# EAGLE schematic OLM-base-v.REV-2-SMT (EAGLE 6.4)
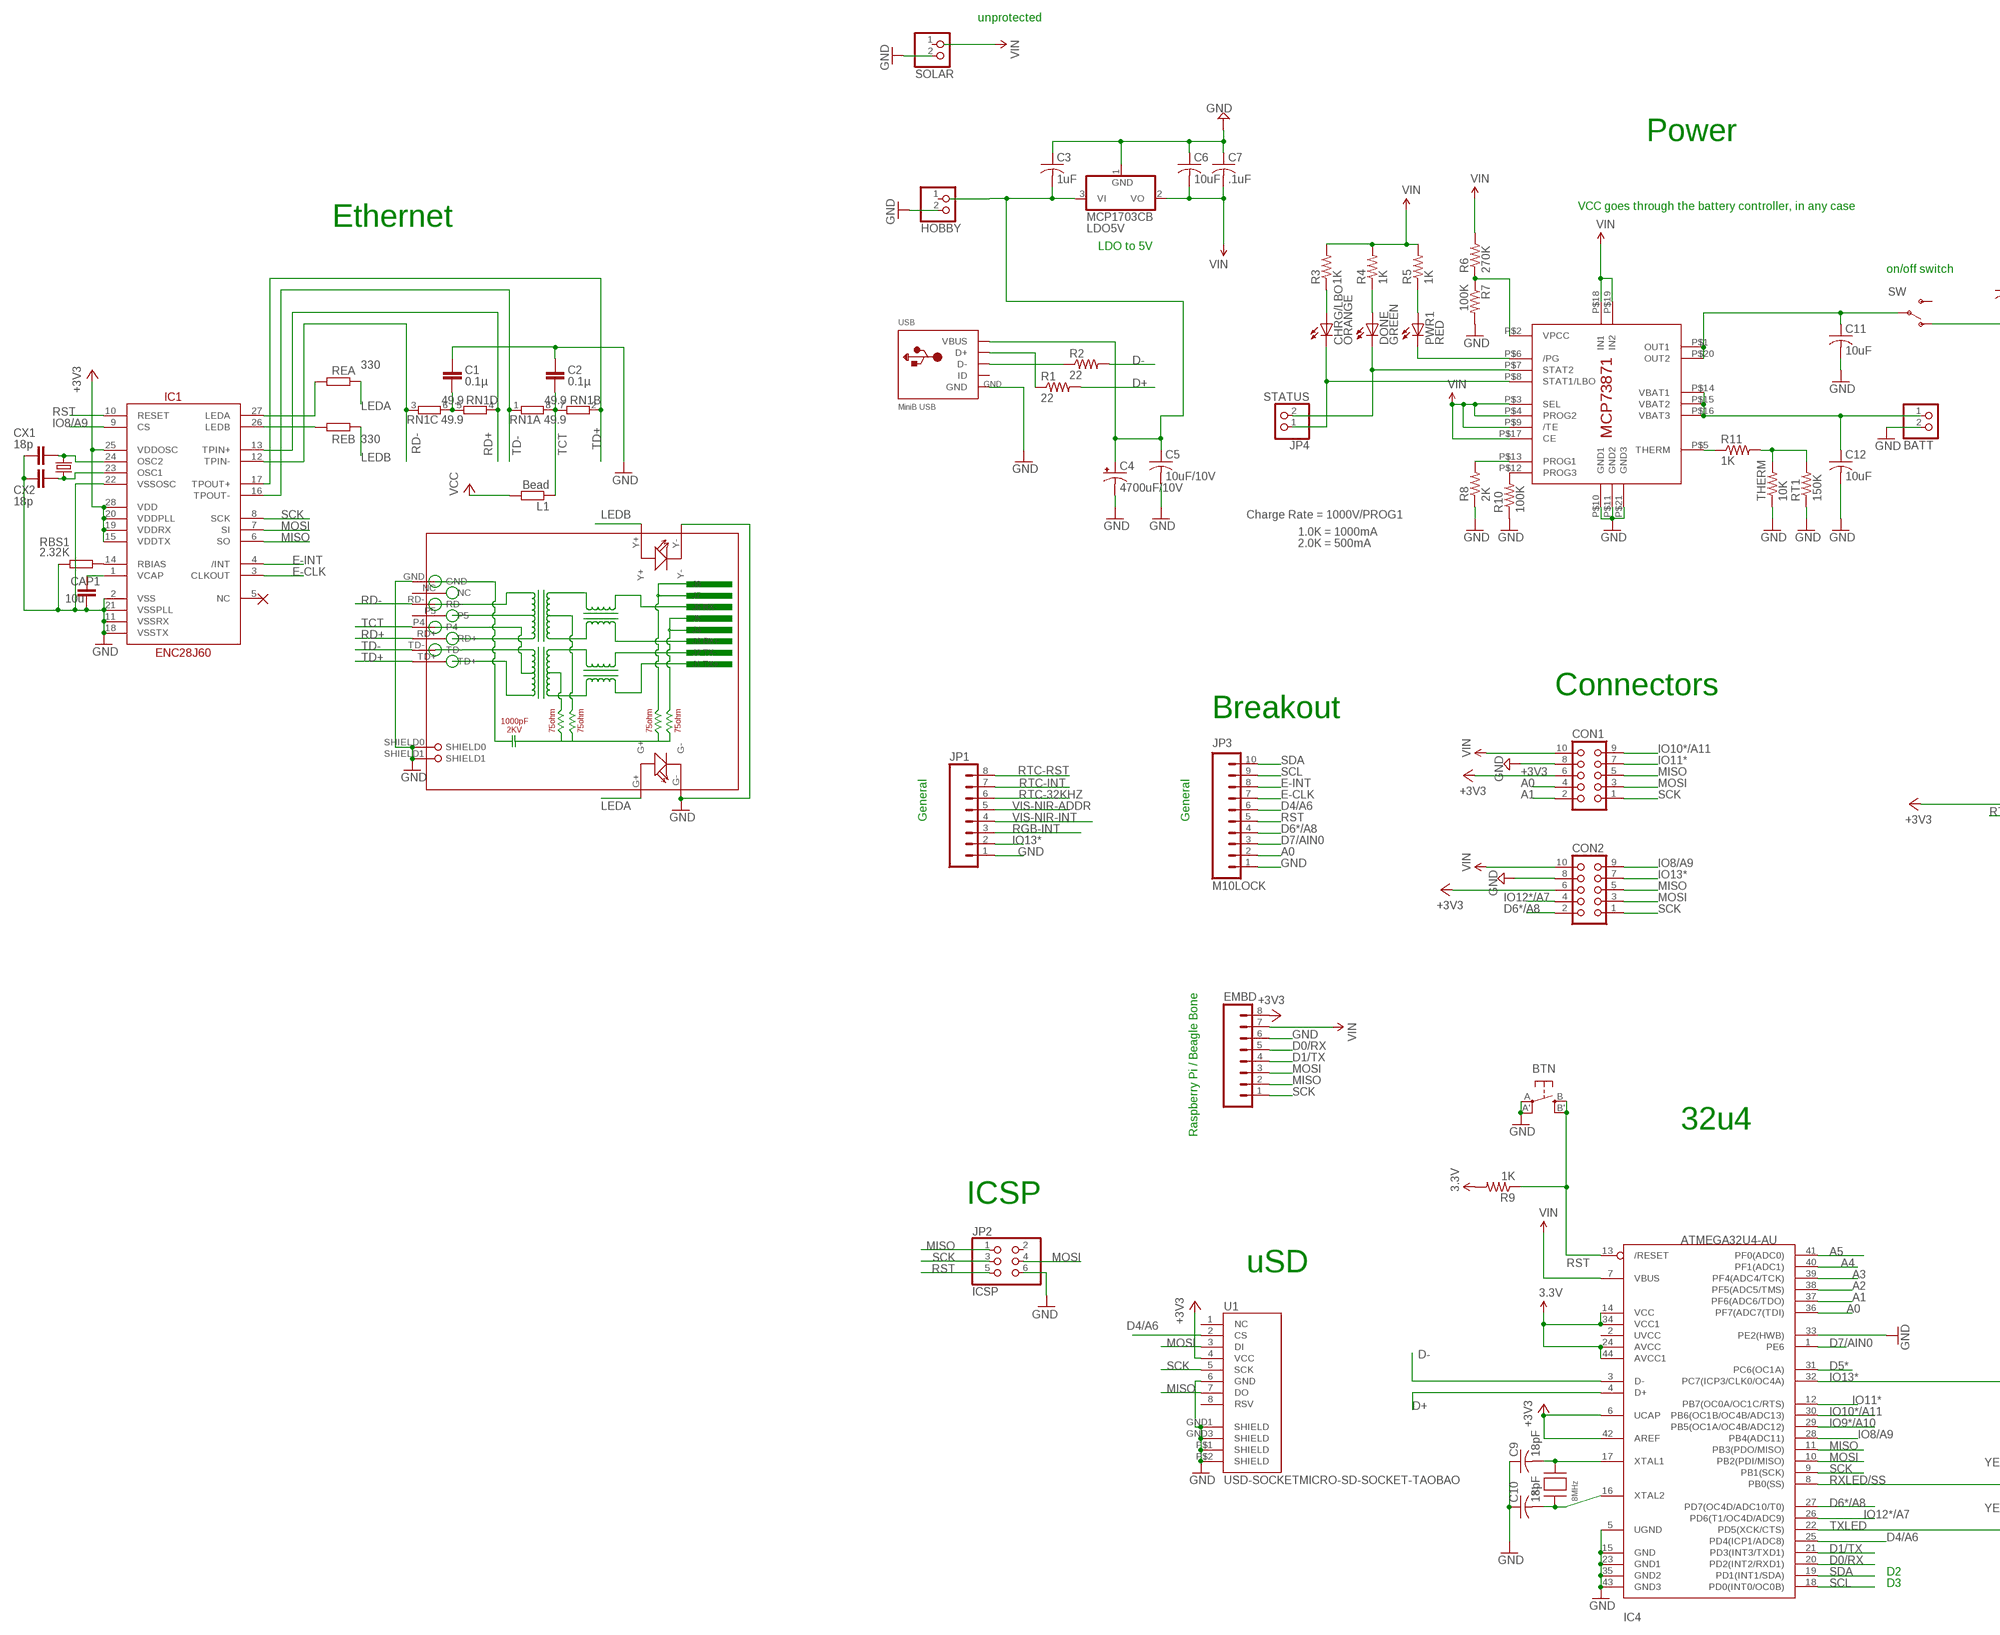
[diagram p0: schematic, sheet 1, part 1 of 2]
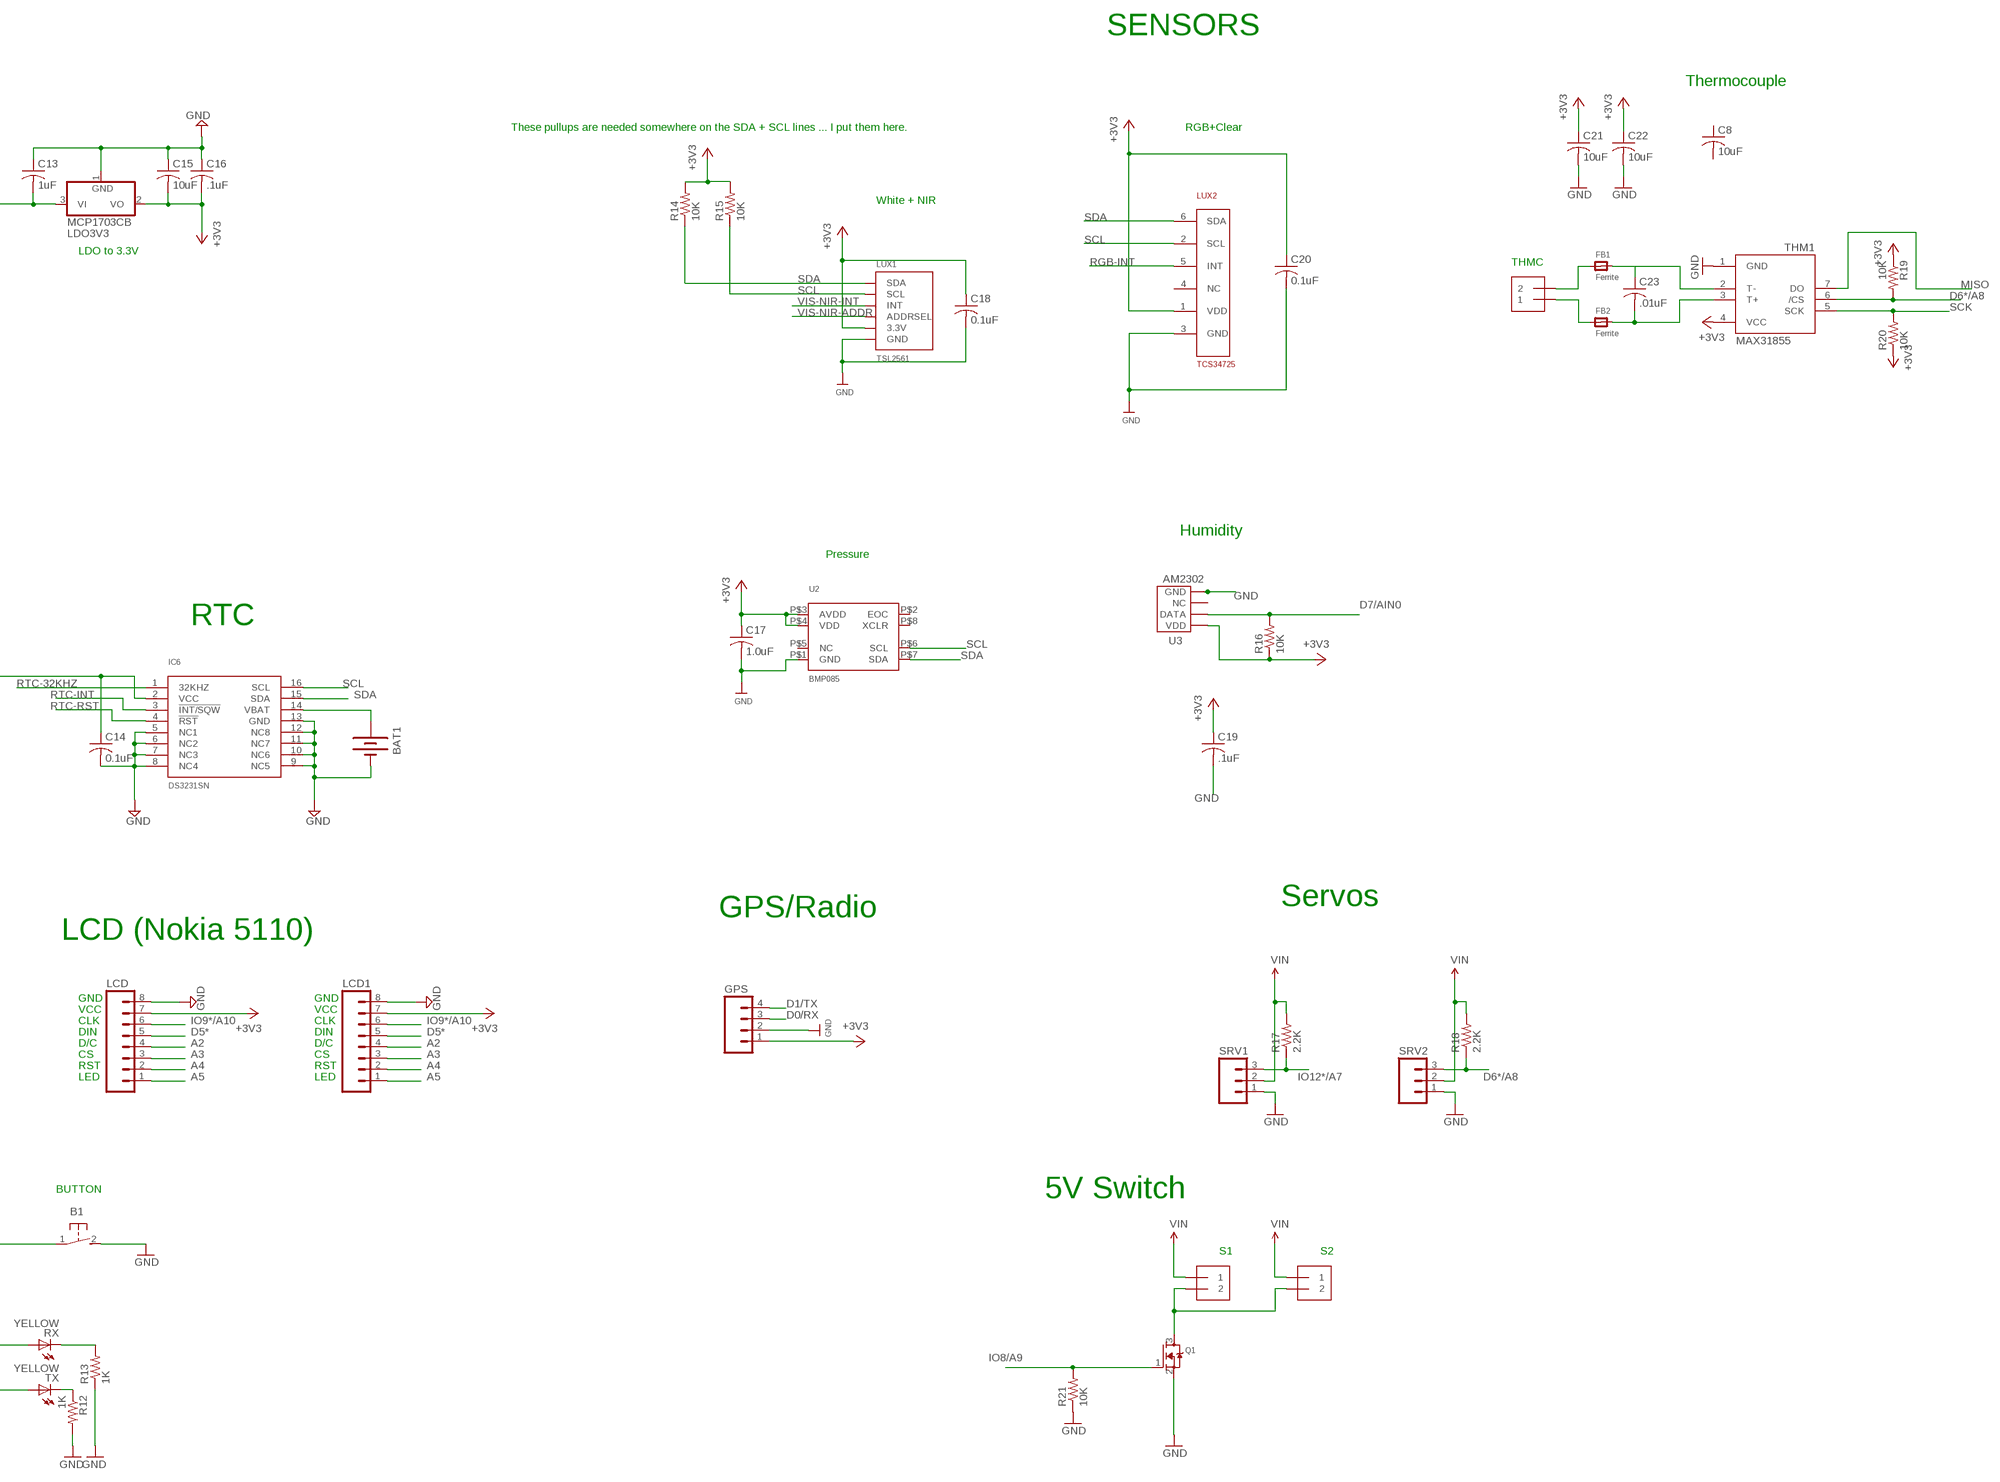
[diagram p1: schematic, sheet 1, part 2 of 2]

## Parts
B1  31-XX  [B3F-31XX]
BAT1  BATTERYBATTERY_12MM_SMT  [BATTCON_12MM_SMT]
BATT  JST_2PIN-SMT-RA  [JST-PH-2-SMT-RA]
BTN  EVQQ2  [EVQ-Q2]
C1  0.1µ  C-EUC0805  [C0805]
C2  0.1µ  C-EUC0805  [C0805]
C3  1uF  C-USC0805  [C0805]
C4  4700uF/10V  CPOL-USE5-13  [E5-13]
C5  10uF/10V  C-USC0805  [C0805]
C6  10uF  C-USC0805  [C0805]
C7  .1uF  C-USC0805  [C0805]
C8  10uF  C-USC0805  [C0805]
C9  18pF  C-USC0805  [C0805]
C10  18pF  C-USC0805  [C0805]
C11  10uF  C-USC0805  [C0805]
C12  10uF  C-USC0805  [C0805]
C13  1uF  C-USC0805  [C0805]
C14  0.1uF  C-USC0805  [C0805]
C15  10uF  C-USC0805  [C0805]
C16  .1uF  C-USC0805  [C0805]
C17  1.0uF  C-USC0805  [C0805]
C18  0.1uF  C-USC0805  [C0805]
C19  .1uF  C-USC0805  [C0805]
C20  0.1uF  C-USC0805  [C0805]
C21  10uF  C-USC0805  [C0805]
C22  10uF  C-USC0805  [C0805]
C23  .01uF  C-USC0805  [C0805]
CAP1  10u  C-EUC0805  [C0805]
CHRG/LBO  ORANGE  LEDCHIP-LED0805  [CHIP-LED0805]
CON1  CON10L  [CON10L]
CON2  CON10L  [CON10L]
CX1  18p  C-EUC0805  [C0805]
CX2  18p  C-EUC0805  [C0805]
DONE  GREEN  LEDCHIP-LED0805  [CHIP-LED0805]
EMBD  M08LOCK  [1X08_LOCK]
FB1  Ferrite  FERRITE_0805  [_0805]
FB2  Ferrite  FERRITE_0805  [_0805]
GPS  M04LOCK  [1X04_LOCK]
HOBBY  JST_2PIN-SMT-RA  [JST-PH-2-SMT-RA]
IC1  ENC28J60  ENC28J60SO28LONG  [SOIC28WLONG]
IC3  MCP73871  [QFN20_4MM]
IC4  ATMEGA32U4-AU  [TQFP44]
IC6  DS3231SN  [SO16W]
JP1  M08LOCK  [1X08_LOCK]
JP2  ICSP  PINHD-2X3  [2X03]
JP3  M10LOCK  [1X10_LOCK]
JP4  STATUS  HEADER-1X2  [1X02_OVAL]
L1  Bead  R-EU_R0805  [R0805]
LCD  M08LOCK  [1X08_LOCK]
LCD1  M08LOCK  [1X08_LOCK]
LDO3V3  MCP1703CB  [SOT23]
LDO5V  MCP1703CB  [SOT23]
LUX1  TSL2561  [TSL2561_FN@1]
LUX2  TCS34725  [DFN-6]
PWR1  RED  LEDCHIP-LED0805  [CHIP-LED0805]
Q1  MOSFET-NREFLOW  [SOT23]
R1  22  R-US_R0805  [R0805]
R2  22  R-US_R0805  [R0805]
R3  1K  R-US_R0805  [R0805]
R4  1K  R-US_R0805  [R0805]
R5  1K  R-US_R0805  [R0805]
R6  270K  R-US_R0805  [R0805]
R7  100K  R-US_R0805  [R0805]
R8  2K  R-US_FLIPFLOP  [0805-THM]
R9  1K  R-US_R0805  [R0805]
R10  100K  R-US_R0805  [R0805]
R11  1K  R-US_M0805  [M0805]
R12  1K  R-US_R0805  [R0805]
R13  1K  R-US_R0805  [R0805]
R14  10K  R-US_R0805  [R0805]
R15  10K  R-US_R0805  [R0805]
R16  10K  R-US_R0805  [R0805]
R17  2.2K  R-US_R0805  [R0805]
R18  2.2K  R-US_R0805  [R0805]
R19  10K  R-US_R0805  [R0805]
R20  10K  R-US_R0805  [R0805]
R21  10K  R-US_R0805  [R0805]
RBS1  2.32K  R-EU_R0805  [R0805]
REA  330  R-EU_R0805  [R0805]
REB  330  R-EU_R0805  [R0805]
RJ1  HR911105A  [HR911105A]
RN1  49.9  4R-NEXB38V  [EXB38V]
RT1  150K  R-US_M0805  [M0805]
RX  YELLOW  LEDCHIPLED_0805  [CHIPLED_0805]
S1  1X2-3.5MM  [1X2-3.5MM]
S2  1X2-3.5MM  [1X2-3.5MM]
SOLAR  JST_2PIN-SMT-RA  [JST-PH-2-SMT-RA]
SRV1  M03PTH  [1X03]
SRV2  M03PTH  [1X03]
SW  SPDT  SWITCH-SPSTSMD2  [SWITCH-SPDT-SMD]
THERM  10K  R-US_FLIPFLOP  [0805-THM]
THM1  MAX31855  MAX6675  [SO08]
THMC  1X2-3.5MM  [1X2-3.5MM]
TX  YELLOW  LEDCHIPLED_0805  [CHIPLED_0805]
U1  USD-SOCKETMICRO-SD-SOCKET-TAOBAO  [MICRO-SD-SOCKET-TAOBAO]
U2  BMP085  [BMP085]
U3  AM2302  [AM2302]
USB  MiniB USB  USBMINIBLARGE  [USB-MINIB_LARGER]
X1  8MHz  XTALNX5032  [NX5032]
X2A  25MHz  CRYSTAL10.5X4.8  [CRYSTAL-SMD-10.5X4.8-2PIN]

## Nets
+3V3: C14.1 C15.2 C16.2 C17.1 C18.1 C19.1 C20.1 C21.1 C22.1 CON1.6 CON2.6 EMBD.8 GPS.1 IC1.15(VDDTX) IC1.19(VDDRX) IC1.20(VDDPLL) IC1.25(VDDOSC) IC1.28(VDD) IC4.6(UCAP) IC4.42(AREF) IC6.2(VCC) LCD1.7 LCD.7 LDO3V3.2(VO) LUX1.VDD(3.3V) LUX2.1(VDD) R14.2 R15.2 R16.1 R19.1 R20.1 THM1.4(VCC) U1.4(VCC) U2.P$3(AVDD) U2.P$4(VDD) U3.P$1(VDD)
A0: CON1.4 IC4.36(PF7(ADC7(TDI)) JP3.2
A1: CON1.2 IC4.37(PF6(ADC6/TDO))
A2: IC4.38(PF5(ADC5/TMS)) LCD1.4 LCD.4
A3: IC4.39(PF4(ADC4/TCK)) LCD1.3 LCD.3
A4: IC4.40(PF1(ADC1)) LCD1.2 LCD.2
A5: IC4.41(PF0(ADC0)) LCD1.1 LCD.1
BATT: BATT.1 C12.1 IC3.P$14(VBAT1) IC3.P$15(VBAT2) IC3.P$16(VBAT3)
D0/RX: EMBD.5 GPS.3 IC4.20(PD2(INT2/RXD1))
D1/TX: EMBD.4 GPS.4 IC4.21(PD3(INT3/TXD1))
D4/A6: IC4.25(PD4(ICP1/ADC8)) JP3.6 U1.2(CS)
D5*: IC4.31(PC6(OC1A)) LCD1.5 LCD.5
D6*/A8: CON2.2 IC4.27(PD7(OC4D/ADC10/T0)) JP3.4 R18.1 R19.2 SRV2.3 THM1.6(/CS)
D7/AIN0: IC4.1(PE6) JP3.3 R16.2 U3.P$2(DATA)
D+: IC4.4(D+) R1.2
D-: IC4.3(D-) R2.2
E-CLK: IC1.3(CLKOUT) JP3.7
E-INT: IC1.4(/INT) JP3.8
GND: B1.2(S) BAT1.P$1(-) BATT.2 BTN.A'(P1) BTN.A(P) C1.1 C2.1 C3.1 C4.- C5.2 C6.1 C7.1 C9.1 C10.1 C11.2 C12.2 C13.1 C14.2 C15.1 C16.1 C17.2 C18.2 C19.2 C20.2 C21.2 C22.2 CAP1.2 CON1.8 CON2.8 CX1.2 CX2.2 EMBD.6 GPS.2 HOBBY.2 IC1.2(VSS) IC1.11(VSSRX) IC1.18(VSSTX) IC1.21(VSSPLL) IC1.22(VSSOSC) IC3.P$10(GND1) IC3.P$11(GND2) IC3.P$21(GND3) IC4.5(UGND) IC4.15(GND) IC4.23(GND1) IC4.33(PE2(HWB)) IC4.35(GND2) IC4.43(GND3) IC6.5(NC1) IC6.6(NC2) IC6.7(NC3) IC6.8(NC4) IC6.9(NC5) IC6.10(NC6) IC6.11(NC7) IC6.12(NC8) IC6.13(GND) JP1.1 JP2.6 JP3.1 LCD1.8 LCD.8 LDO3V3.1(GND) LDO5V.1(GND) LUX1.VSS(GND) LUX2.3(GND) Q1.2(S) R7.2 R8.1 R10.1 R12.2 R13.1 R21.1 RBS1.1 RJ1.G- RJ1.GND RJ1.SHIELD0 RJ1.SHIELD1 RJ1.Y- RT1.1 SOLAR.2 SRV1.1 SRV2.1 THERM.1 THM1.1(GND) U1.6(GND) U1.GND1(SHIELD) U1.GND3(SHIELD) U1.P$1(SHIELD) U1.P$2(SHIELD) U2.P$1(GND) U3.P$4(GND) USB.GND
HIGH-CURRENT: Q1.3(D) S1.2 S2.2
IO8/A9: CON2.9 IC1.9(CS) IC4.28(PB4(ADC11)) Q1.1(G) R21.2
IO9*/A10: IC4.29(PB5(OC1A/OC4B/ADC12)) LCD1.6 LCD.6
IO10*/A11: CON1.9 IC4.30(PB6(OC1B/OC4B/ADC13))
IO11*: CON1.7 IC4.12(PB7(OC0A/OC1C/RTS))
IO12*/A7: CON2.4 IC4.26(PD6(T1/OC4D/ADC9)) R17.1 SRV1.3
IO13*: B1.1(P) CON2.7 IC4.32(PC7(ICP3/CLK0/OC4A)) JP1.2
LEDA: REA.2 RJ1.G+
LEDB: REB.2 RJ1.Y+
MISO: CON1.5 CON2.5 EMBD.2 IC1.6(SO) IC4.11(PB3(PDO/MISO)) JP2.1 THM1.7(DO) U1.7(DO)
MOSI: CON1.3 CON2.3 EMBD.3 IC1.7(SI) IC4.10(PB2(PDI/MISO)) JP2.4 U1.3(DI)
N$1: BAT1.P$2(+) IC6.14(VBAT)
N$2: IC1.27(LEDA) REA.1
N$3: FB1.1 THMC.2
N$4: C23.1 FB1.2 THM1.2(T-)
N$5: FB2.1 THMC.1
N$6: C23.2 FB2.2 THM1.3(T+)
N$8: C9.2 IC4.17(XTAL1) X1.P$2
N$9: C10.2 IC4.16(XTAL2) X1.P$1
N$10: C1.2 RN1.5 RN1.6
N$11: R12.1 TX.C
N$12: R13.2 RX.C
N$15: IC1.26(LEDB) REB.1
N$16: CAP1.1 IC1.1(VCAP)
N$17: IC1.14(RBIAS) RBS1.2
N$18: CX1.1 IC1.24(OSC2) X2A.P$2
N$19: CX2.1 IC1.23(OSC1) X2A.P$1
N$20: IC3.P$2(VPCC) R6.1 R7.1
N$21: IC3.P$6(/PG) PWR1.C
N$22: C3.2 C4.+ C5.1 LDO5V.3(VI) USB.VBUS
N$23: DONE.C IC3.P$7(STAT2) JP4.2
N$29: CHRG/LBO.C IC3.P$8(STAT1/LBO) JP4.1
N$30: CHRG/LBO.A R3.1
N$31: DONE.A R4.1
N$32: PWR1.A R5.1
N$33: IC3.P$12(PROG3) R10.2
N$34: IC3.P$13(PROG1) R8.2
N$35: C11.1 IC3.P$1(OUT1) IC3.P$20(OUT2) SW.2(P)
N$36: IC3.P$5(THERM) R11.1
N$37: R11.2 RT1.2 THERM.2
N$41: R1.1 USB.D+
N$42: R2.1 USB.D-
N$44: C13.2 LDO3V3.3(VI)
RD+: IC1.13(TPIN+) RJ1.RD+ RN1.4
RD-: IC1.12(TPIN-) RJ1.RD- RN1.3
RGB-INT: JP1.3 LUX2.5(INT)
RST: BTN.B'(S1) BTN.B(S) IC1.10(RESET) IC4.13(/RESET) JP2.5 JP3.5 R9.1
RTC-32KHZ: IC6.1(32KHZ) JP1.6
RTC-INT: IC6.3(!INT/SQW) JP1.7
RTC-RST: IC6.4(!RST) JP1.8
RXLED/SS: IC4.8(PB0(SS)) RX.A
SCK: CON1.1 CON2.1 EMBD.1 IC1.8(SCK) IC4.9(PB1(SCK)) JP2.3 R20.2 THM1.5(SCK) U1.5(SCK)
SCL: IC4.18(PD0(INT0/OC0B)) IC6.16(SCL) JP3.9 LUX1.CLK(SCL) LUX2.2(SCL) R15.1 U2.P$6(SCL)
SDA: IC4.19(PD1(INT1/SDA)) IC6.15(SDA) JP3.10 LUX1.DATA(SDA) LUX2.6(SDA) R14.1 U2.P$7(SDA)
TCT: C2.2 L1.1 RJ1.P4 RN1.7 RN1.8
TD+: IC1.17(TPOUT+) RJ1.TD+ RN1.2
TD-: IC1.16(TPOUT-) RJ1.TD- RN1.1
TXLED: IC4.22(PD5(XCK/CTS)) TX.A
VCC: IC4.14(VCC) IC4.24(AVCC) IC4.34(VCC1) IC4.44(AVCC1) L1.2 R9.2 ; supply symbol labelled 3.3V
VIN: C6.2 C7.2 CON1.10 CON2.10 EMBD.7 IC3.P$3(SEL) IC3.P$4(PROG2) IC3.P$9(/TE) IC3.P$17(CE) IC3.P$18(IN1) IC3.P$19(IN2) IC4.7(VBUS) LDO5V.2(VO) R3.2 R4.2 R5.2 R6.2 R17.2 R18.2 S1.1 S2.1 SRV1.2 SRV2.2
VIS-NIR-ADDR: JP1.5 LUX1.ADR(ADDRSEL)
VIS-NIR-INT: JP1.4 LUX1.INT
Unconnected: C8.1 C8.2 HOBBY.1 IC1.5(NC) IC4.2(UVCC) JP2.2 LUX2.4(NC) RJ1.NC RJ1.P5 SOLAR.1 SW.1(O) SW.3(S) U1.1(NC) U1.8(RSV) U2.P$2(EOC) U2.P$5(NC) U2.P$8(XCLR) U3.P$3(NC) USB.ID

## Notes on the sheet
- unprotected
- Power
- SENSORS
- Thermocouple
- VCC goes through the battery controller, in any case
- Ethernet
- LDO to 5V | These pullups are needed somewhere on the SDA + SCL lines ... I put them here. | RGB+Clear
- on/off switch
- White + NIR
- LDO to 3.3V
- THMC
- Charge Rate = 1000V/PROG1
- 1.0K = 1000mA
- 2.0K = 500mA
- Humidity
- Pressure
- Connectors
- Breakout
- RTC
- General | General
- Raspberry Pi / Beagle Bone
- Servos
- GPS/Radio
- LCD (Nokia 5110)
- 32u4
- GND | GND
- VCC | VCC
- CLK | CLK
- DIN | DIN
- D/C | D/C
- CS | CS
- ICSP | RST | RST
- LED | LED
- uSD
- BUTTON
- 5V Switch
- S1 | S2
- D2
- D3

## Library data of the parts
B1 = adafruit:31-XX: OMRON SWITCH Now with beefier pads!
BAT1 = SparkFunNew:BATTERY: Battery Holders Various common sizes : AA, AAA, 20mm coin cell and 12mm coin cell.
BATT HOBBY SOLAR = adafruit:JST_2PIN: JST 2-Pin Connectors of various flavors SMT-RA (S2B-PH-SM4) 4UConnector #17311 SMT (B2B-PH-SM4) THM-RA (S2B-PH) THM (B2B-PH)
BTN = adafruit:EVQQ2: SMT 6mm switch, EVQQ2 series http://www.ladyada.net/library/eagle
C1 C2 CAP1 CX1 CX2 = resistor:C-EU: CAPACITOR, European symbol
C3 C5-C13 C15-C23 = adafruit:C-US: CAPACITOR, American symbol
C4 = adafruit:CPOL-US: POLARIZED CAPACITOR, American symbol
C14 = rcl:C-US: CAPACITOR, American symbol
CHRG/LBO DONE PWR1 RX TX = adafruit:LED: LED OSRAM: - CHIPLED LG R971, LG N971, LY N971, LG Q971, LY Q971, LO R971, LY R971 LH N974, LH R974 LS Q976, LO Q976, LY Q976 LO Q996 - Hyper CHIPLED LW Q18S LB Q993, LB Q99A, LB R99A - SideLED LS A670, LO A670, LY A670, LG A670, LP A670 LB A673, LV A673, LT A673, LW A673 LH A674 LY A675 LS A676, LA A676, LO A676, LY A676, LW A676 LS A679, LY A679, LG A679 - Hyper Micro SIDELED® LS Y876, LA Y876, LO Y876, LY Y876 LT Y87S - SmartLED LW L88C, LW L88S LB L89C, LB L89S, LG L890 LS L89K, LO L89K, LY L89K LS L896, LA L896, LO L896, LY L896 - TOPLED LS T670, LO T670, LY T670, LG T670, LP T670 LSG T670, LSP T670, LSY T670, LOP T670, LYG T670 LG T671, LOG T671, LSG T671 LB T673, LV T673, LT T673, LW T673 LH T674 LS T676, LA T676, LO T676, LY T676, LB T676, LH T676, LSB T676, LW T676 LB T67C, LV T67C, LT T67C, LS T67K, LO T67K, LY T67K, LW E67C LS E67B, LA E67B, LO E67B, LY E67B, LB E67C, LV E67C, LT E67C LW T67C LS T679, LY T679, LG T679 LS T770, LO T770, LY T770, LG T770, LP T770 LB T773, LV T773, LT T773, LW T773 LH T774 LS E675, LA E675, LY E675, LS T675 LS T776, LA T776, LO T776, LY T776, LB T776 LHGB T686 LT T68C, LB T68C - Hyper Mini TOPLED® LB M676 - Mini TOPLED Santana® LG M470 LS M47K, LO M47K, LY M47K Source: http://www.osram.convergy.de/
CON1 CON2 = con-harting:CON10L: CONNECTOR; OC_FARNELL: unknown; OC_NEWARK: unknown
EMBD JP1 LCD LCD1 = SparkFun-Connectors:M08: Header 8 Standard 8-pin 0.1" header. Use with straight break away headers (SKU : PRT-00116), right angle break away headers (PRT-00553), swiss pins (PRT-00743), machine pins (PRT-00117), and female headers (PRT-00115).
FB1 FB2 = microbuilder:FERRITE: Ferrite Bead 0603 MMZ1608B121C - 120 Ohm @ 100MHz, 600mA, 0.15 Ohm DC Resistance - Digikey: 445-2164-1-ND BK1608HW121-T - 120 Ohm, 600mA Ferrite Chip - Digikey: 587-1876-2-ND 0805 HZ0805B272R-10 - 2.7K Ohm @ 100MHz, 200mA, 0.8 Ohm DC Resistance - Digikey: 240-2504-1-ND (see also Murata BLM21BD272SN1L) MMZ2012Y152B - 1.5K Ohm @ 100MHz, 500mA, 0.4 Ohm DC Resistance - Digikey: 445-1560-1-ND - Mainly for high frequency (80-400MHz) MMZ2012R102A - 1K Ohm @ 100MHz, 500mA, 0.3 Ohm DC Resistance - Digikey: 445-1555-2-ND - More general purpose (10-200MHz)
GPS = SparkFun-Connectors:M04: Header 4 Standard 4-pin 0.1" header. Use with straight break away headers (SKU : PRT-00116), right angle break away headers (PRT-00553), swiss pins (PRT-00743), machine pins (PRT-00117), and female headers (PRT-00115). Molex polarized connector foot print use with SKU : PRT-08231 with associated crimp pins and housings. 1MM SMD Version SKU: PRT-10208
IC1 = SparkFun:ENC28J60
IC3 = adafruit:MCP73871
IC4 = adaprog:ATMEGA32U4
IC6 = comfile:DS3231SN
JP2 = pinhead:PINHD-2X3: PIN HEADER
JP3 = SparkFun-Connectors:M10: Header 10 Standard 10-pin 0.1" header. Use with straight break away headers (SKU : PRT-00116), right angle break away headers (PRT-00553), swiss pins (PRT-00743), machine pins (PRT-00117), and female headers (PRT-00115).
JP4 = microbuilder:HEADER-1X2: PIN HEADER
L1 RBS1 REA REB = rcl:R-EU_: RESISTOR, European symbol
LDO3V3 LDO5V = linear:MCP1703: 250 mA, 16V, Low Quiescent Current LDO Regulator Source: http://ww1.microchip.com/downloads/en/DeviceDoc/22049b.pdf
LUX1 = microbuilder:TSL2561: TSL2561 Light-To-Digital Sensor Mouser Part Numbers: CS (obsolete): 856-TSL2561CS DFN (cheapest): 856-TSL2561FN
LUX2 = dwbLibrary:TCS34725
Q1 = adafruit:MOSFET-N: N-Channel Mosfet 2N7002E - 60V 260mA SOT23 [Digikey: 2N7002ET1GOSTR-ND] - REEL BSH103 - 30V 850mA SOT23 [Digikey: 568-5013-1-ND]
R1-R21 RT1 THERM = adafruit:R-US_: RESISTOR, American symbol
RJ1 = CONNECTER:HR911105A
RN1 = resistor-dil:4R-N: Array Chip Resistor Source: RS Component / Phycomp; OC_FARNELL: unknown; OC_NEWARK: unknown
S1 S2 THMC = adafruit:1X2: 3.5mm Terminal block http://www.ladyada.net/library/pcb/eaglelibrary.html
SRV1 SRV2 = SparkFun:M03: Header 3 Standard 3-pin 0.1" header. Use with straight break away headers (SKU : PRT-00116), right angle break away headers (PRT-00553), swiss pins (PRT-00743), machine pins (PRT-00117), and female headers (PRT-00115). Molex polarized connector foot print use with SKU : PRT-08232 with associated crimp pins and housings.
SW = SparkFun:SWITCH-SPST: SPST Switch Simple slide switch. Spark Fun Electronics SKU : COM-00102
THM1 = adafruit:MAX6675
U1 = SparkFunNew:USD-SOCKET: microSD Socket Push-push type uSD socket. Schematic element and footprint production proven. Spark Fun Electronics SKU : PRT-00127. tDoc lines correctly indicate media card edge positions when inserting (unlocked, locked, depressed).
U2 = microbuilder:BMP085: BMP085 Digital Pressure Sensor 1.8-3.6V Supply, I2C Interface
U3 = sensor:AM2302
USB = microbuilder:USB: USB Connectors USBMINIB - Surface Mount Female Mini-B USB Connector 4UConnector: 06564
X1 = adaprog:XTAL
X2A = SparkFun:CRYSTAL: Crystals Various standard crystals. Proven footprints. Spark Fun Electronics SKU : COM-00534

## Net classes
0 default: width 0.254 mm, clearance 0.203 mm
1 power: width 0.61 mm, clearance 0.203 mm